# EAGLE design DipSeq_panel_12HP_20150408 (EAGLE 7.1.0)
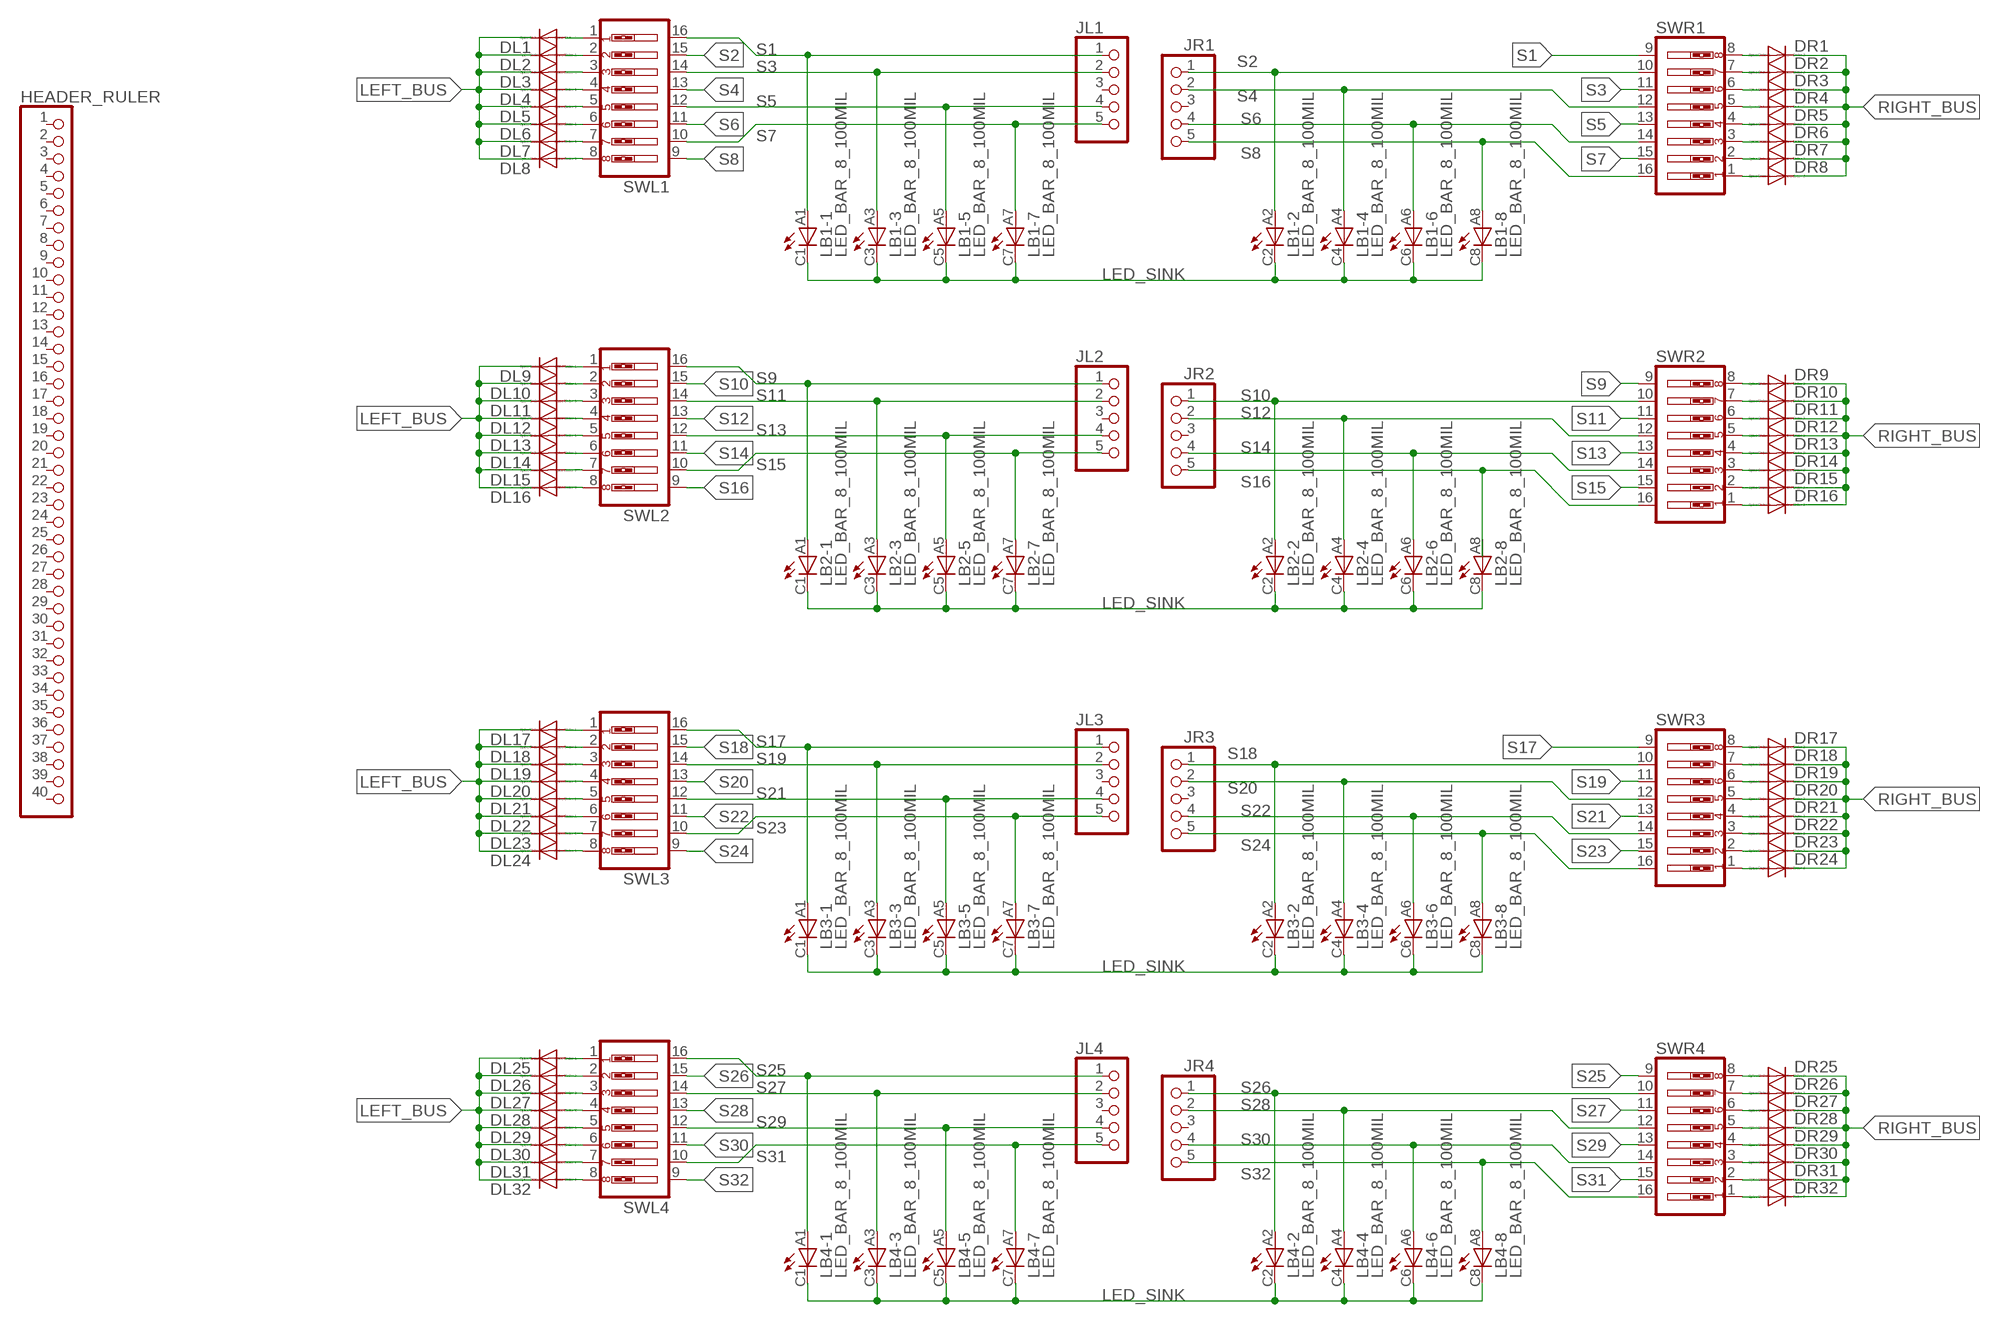
[diagram p0: schematic, sheet 1]

## Parts
DL1  DIODE-SOD323-W  [SOD323-W]
DL2  DIODE-SOD323-W  [SOD323-W]
DL3  DIODE-SOD323-W  [SOD323-W]
DL4  DIODE-SOD323-W  [SOD323-W]
DL5  DIODE-SOD323-W  [SOD323-W]
DL6  DIODE-SOD323-W  [SOD323-W]
DL7  DIODE-SOD323-W  [SOD323-W]
DL8  DIODE-SOD323-W  [SOD323-W]
DL9  DIODE-SOD323-W  [SOD323-W]
DL10  DIODE-SOD323-W  [SOD323-W]
DL11  DIODE-SOD323-W  [SOD323-W]
DL12  DIODE-SOD323-W  [SOD323-W]
DL13  DIODE-SOD323-W  [SOD323-W]
DL14  DIODE-SOD323-W  [SOD323-W]
DL15  DIODE-SOD323-W  [SOD323-W]
DL16  DIODE-SOD323-W  [SOD323-W]
DL17  DIODE-SOD323-W  [SOD323-W]
DL18  DIODE-SOD323-W  [SOD323-W]
DL19  DIODE-SOD323-W  [SOD323-W]
DL20  DIODE-SOD323-W  [SOD323-W]
DL21  DIODE-SOD323-W  [SOD323-W]
DL22  DIODE-SOD323-W  [SOD323-W]
DL23  DIODE-SOD323-W  [SOD323-W]
DL24  DIODE-SOD323-W  [SOD323-W]
DL25  DIODE-SOD323-W  [SOD323-W]
DL26  DIODE-SOD323-W  [SOD323-W]
DL27  DIODE-SOD323-W  [SOD323-W]
DL28  DIODE-SOD323-W  [SOD323-W]
DL29  DIODE-SOD323-W  [SOD323-W]
DL30  DIODE-SOD323-W  [SOD323-W]
DL31  DIODE-SOD323-W  [SOD323-W]
DL32  DIODE-SOD323-W  [SOD323-W]
DR1  DIODE-SOD323-W  [SOD323-W]
DR2  DIODE-SOD323-W  [SOD323-W]
DR3  DIODE-SOD323-W  [SOD323-W]
DR4  DIODE-SOD323-W  [SOD323-W]
DR5  DIODE-SOD323-W  [SOD323-W]
DR6  DIODE-SOD323-W  [SOD323-W]
DR7  DIODE-SOD323-W  [SOD323-W]
DR8  DIODE-SOD323-W  [SOD323-W]
DR9  DIODE-SOD323-W  [SOD323-W]
DR10  DIODE-SOD323-W  [SOD323-W]
DR11  DIODE-SOD323-W  [SOD323-W]
DR12  DIODE-SOD323-W  [SOD323-W]
DR13  DIODE-SOD323-W  [SOD323-W]
DR14  DIODE-SOD323-W  [SOD323-W]
DR15  DIODE-SOD323-W  [SOD323-W]
DR16  DIODE-SOD323-W  [SOD323-W]
DR17  DIODE-SOD323-W  [SOD323-W]
DR18  DIODE-SOD323-W  [SOD323-W]
DR19  DIODE-SOD323-W  [SOD323-W]
DR20  DIODE-SOD323-W  [SOD323-W]
DR21  DIODE-SOD323-W  [SOD323-W]
DR22  DIODE-SOD323-W  [SOD323-W]
DR23  DIODE-SOD323-W  [SOD323-W]
DR24  DIODE-SOD323-W  [SOD323-W]
DR25  DIODE-SOD323-W  [SOD323-W]
DR26  DIODE-SOD323-W  [SOD323-W]
DR27  DIODE-SOD323-W  [SOD323-W]
DR28  DIODE-SOD323-W  [SOD323-W]
DR29  DIODE-SOD323-W  [SOD323-W]
DR30  DIODE-SOD323-W  [SOD323-W]
DR31  DIODE-SOD323-W  [SOD323-W]
DR32  DIODE-SOD323-W  [SOD323-W]
HEADER_RULER  PINHD-1X40  [1X40]
JL1  PINHD-1X5  [1X05]
JL2  PINHD-1X5  [1X05]
JL3  PINHD-1X5  [1X05]
JL4  PINHD-1X5  [1X05]
JR1  PINHD-1X5  [1X05]
JR2  PINHD-1X5  [1X05]
JR3  PINHD-1X5  [1X05]
JR4  PINHD-1X5  [1X05]
LB1  LED_BAR_8_100MIL  [LED_BAR_8]
LB2  LED_BAR_8_100MIL  [LED_BAR_8]
LB3  LED_BAR_8_100MIL  [LED_BAR_8]
LB4  LED_BAR_8_100MIL  [LED_BAR_8]
SWL1  SW_DIP-8PIANO_STYLE  [PIANO_DIPSWITCH_08]
SWL2  SW_DIP-8PIANO_STYLE  [PIANO_DIPSWITCH_08]
SWL3  SW_DIP-8PIANO_STYLE  [PIANO_DIPSWITCH_08]
SWL4  SW_DIP-8PIANO_STYLE  [PIANO_DIPSWITCH_08]
SWR1  SW_DIP-8PIANO_STYLE  [PIANO_DIPSWITCH_08]
SWR2  SW_DIP-8PIANO_STYLE  [PIANO_DIPSWITCH_08]
SWR3  SW_DIP-8PIANO_STYLE  [PIANO_DIPSWITCH_08]
SWR4  SW_DIP-8PIANO_STYLE  [PIANO_DIPSWITCH_08]

## Nets
LED_SINK: LB1.C1(-1:C) LB1.C2(-2:C) LB1.C3(-3:C) LB1.C4(-4:C) LB1.C5(-5:C) LB1.C6(-6:C) LB1.C7(-7:C) LB1.C8(-8:C) LB2.C1(-1:C) LB2.C2(-2:C) LB2.C3(-3:C) LB2.C4(-4:C) LB2.C5(-5:C) LB2.C6(-6:C) LB2.C7(-7:C) LB2.C8(-8:C) LB3.C1(-1:C) LB3.C2(-2:C) LB3.C3(-3:C) LB3.C4(-4:C) LB3.C5(-5:C) LB3.C6(-6:C) LB3.C7(-7:C) LB3.C8(-8:C) LB4.C1(-1:C) LB4.C2(-2:C) LB4.C3(-3:C) LB4.C4(-4:C) LB4.C5(-5:C) LB4.C6(-6:C) LB4.C7(-7:C) LB4.C8(-8:C)
LEFT_BUS: DL1.C DL2.C DL3.C DL4.C DL5.C DL6.C DL7.C DL8.C DL9.C DL10.C DL11.C DL12.C DL13.C DL14.C DL15.C DL16.C DL17.C DL18.C DL19.C DL20.C DL21.C DL22.C DL23.C DL24.C DL25.C DL26.C DL27.C DL28.C DL29.C DL30.C DL31.C DL32.C
N$1: DL1.A SWL1.1
N$2: DL2.A SWL1.2
N$3: DL3.A SWL1.3
N$4: DL4.A SWL1.4
N$17: DL5.A SWL1.5
N$18: DL6.A SWL1.6
N$19: DL7.A SWL1.7
N$20: DL8.A SWL1.8
N$21: DR1.A SWR1.8
N$22: DR2.A SWR1.7
N$23: DR3.A SWR1.6
N$24: DR8.A SWR1.1
N$25: DR7.A SWR1.2
N$26: DR6.A SWR1.3
N$27: DR5.A SWR1.4
N$28: DR4.A SWR1.5
N$29: DL9.A SWL2.1
N$30: DL10.A SWL2.2
N$31: DL11.A SWL2.3
N$32: DL12.A SWL2.4
N$33: DL15.A SWL2.7
N$34: DL16.A SWL2.8
N$35: DR9.A SWR2.8
N$36: DR10.A SWR2.7
N$37: DR11.A SWR2.6
N$38: DR16.A SWR2.1
N$39: DR15.A SWR2.2
N$40: DR14.A SWR2.3
N$41: DR13.A SWR2.4
N$42: DR12.A SWR2.5
N$43: DL13.A SWL2.5
N$44: DL14.A SWL2.6
N$45: DL17.A SWL3.1
N$46: DL18.A SWL3.2
N$47: DL19.A SWL3.3
N$48: DL20.A SWL3.4
N$49: DL23.A SWL3.7
N$50: DL24.A SWL3.8
N$51: DR17.A SWR3.8
N$52: DR18.A SWR3.7
N$53: DR19.A SWR3.6
N$54: DR24.A SWR3.1
N$55: DR23.A SWR3.2
N$56: DR22.A SWR3.3
N$57: DR21.A SWR3.4
N$58: DR20.A SWR3.5
N$59: DL21.A SWL3.5
N$60: DL22.A SWL3.6
N$61: DL25.A SWL4.1
N$62: DL26.A SWL4.2
N$63: DL27.A SWL4.3
N$64: DL28.A SWL4.4
N$65: DL31.A SWL4.7
N$66: DL32.A SWL4.8
N$67: DR25.A SWR4.8
N$68: DR26.A SWR4.7
N$69: DR27.A SWR4.6
N$70: DR32.A SWR4.1
N$71: DR31.A SWR4.2
N$72: DR30.A SWR4.3
N$73: DR29.A SWR4.4
N$74: DR28.A SWR4.5
N$75: DL29.A SWL4.5
N$76: DL30.A SWL4.6
RIGHT_BUS: DR1.C DR2.C DR3.C DR4.C DR5.C DR6.C DR7.C DR8.C DR9.C DR10.C DR11.C DR12.C DR13.C DR14.C DR15.C DR16.C DR17.C DR18.C DR19.C DR20.C DR21.C DR22.C DR23.C DR24.C DR25.C DR26.C DR27.C DR28.C DR29.C DR30.C DR31.C DR32.C
S1: JL1.1 LB1.A1(-1:A) SWL1.16 SWR1.9
S2: JR1.1 LB1.A2(-2:A) SWL1.15 SWR1.10
S3: JL1.2 LB1.A3(-3:A) SWL1.14 SWR1.11
S4: JR1.2 LB1.A4(-4:A) SWL1.13 SWR1.12
S5: JL1.4 LB1.A5(-5:A) SWL1.12 SWR1.13
S6: JR1.4 LB1.A6(-6:A) SWL1.11 SWR1.14
S7: JL1.5 LB1.A7(-7:A) SWL1.10 SWR1.15
S8: JR1.5 LB1.A8(-8:A) SWL1.9 SWR1.16
S9: JL2.1 LB2.A1(-1:A) SWL2.16 SWR2.9
S10: JR2.1 LB2.A2(-2:A) SWL2.15 SWR2.10
S11: JL2.2 LB2.A3(-3:A) SWL2.14 SWR2.11
S12: JR2.2 LB2.A4(-4:A) SWL2.13 SWR2.12
S13: JL2.4 LB2.A5(-5:A) SWL2.12 SWR2.13
S14: JR2.4 LB2.A6(-6:A) SWL2.11 SWR2.14
S15: JL2.5 LB2.A7(-7:A) SWL2.10 SWR2.15
S16: JR2.5 SWL2.9 SWR2.16
S17: JL3.1 LB3.A1(-1:A) SWL3.16 SWR3.9
S18: JR3.1 LB3.A2(-2:A) SWL3.15 SWR3.10
S19: JL3.2 LB3.A3(-3:A) SWL3.14 SWR3.11
S20: JR3.2 LB3.A4(-4:A) SWL3.13 SWR3.12
S21: JL3.4 LB3.A5(-5:A) SWL3.12 SWR3.13
S22: JR3.4 LB3.A6(-6:A) SWL3.11 SWR3.14
S23: JL3.5 LB3.A7(-7:A) SWL3.10 SWR3.15
S24: JR3.5 LB3.A8(-8:A) SWL3.9 SWR3.16
S25: JL4.1 LB4.A1(-1:A) SWL4.16 SWR4.9
S26: JR4.1 LB4.A2(-2:A) SWL4.15 SWR4.10
S27: JL4.2 LB4.A3(-3:A) SWL4.14 SWR4.11
S28: JR4.2 LB4.A4(-4:A) SWL4.13 SWR4.12
S29: JL4.4 LB4.A5(-5:A) SWL4.12 SWR4.13
S30: JR4.4 LB4.A6(-6:A) SWL4.11 SWR4.14
S31: JL4.5 LB4.A7(-7:A) SWL4.10 SWR4.15
S32: JR4.5 LB4.A8(-8:A) SWL4.9 SWR4.16
Unconnected: HEADER_RULER.1 HEADER_RULER.2 HEADER_RULER.3 HEADER_RULER.4 HEADER_RULER.5 HEADER_RULER.6 HEADER_RULER.7 HEADER_RULER.8 HEADER_RULER.9 HEADER_RULER.10 HEADER_RULER.11 HEADER_RULER.12 HEADER_RULER.13 HEADER_RULER.14 HEADER_RULER.15 HEADER_RULER.16 HEADER_RULER.17 HEADER_RULER.18 HEADER_RULER.19 HEADER_RULER.20 HEADER_RULER.21 HEADER_RULER.22 HEADER_RULER.23 HEADER_RULER.24 HEADER_RULER.25 HEADER_RULER.26 HEADER_RULER.27 HEADER_RULER.28 HEADER_RULER.29 HEADER_RULER.30 HEADER_RULER.31 HEADER_RULER.32 HEADER_RULER.33 HEADER_RULER.34 HEADER_RULER.35 HEADER_RULER.36 HEADER_RULER.37 HEADER_RULER.38 HEADER_RULER.39 HEADER_RULER.40 JL1.3 JL2.3 JL3.3 JL4.3 JR1.3 JR2.3 JR3.3 JR4.3 LB2.A8(-8:A)

## Library data of the parts
DL1-DL32 DR1-DR32 = diode:DIODE-: DIODE
HEADER_RULER = pinhead:PINHD-1X40: PIN HEADER
JL1-JL4 JR1-JR4 = amdagan:PINHD-1X5: PIN HEADER
LB1-LB4 = amdagan:LED_BAR_8_100MIL: LED BLOCK 8-LED bar graph, DIL Dealextreme SKU 307214
SWL1-SWL4 SWR1-SWR4 = amdagan:SW_DIP-8: DIP SWITCH

## Board
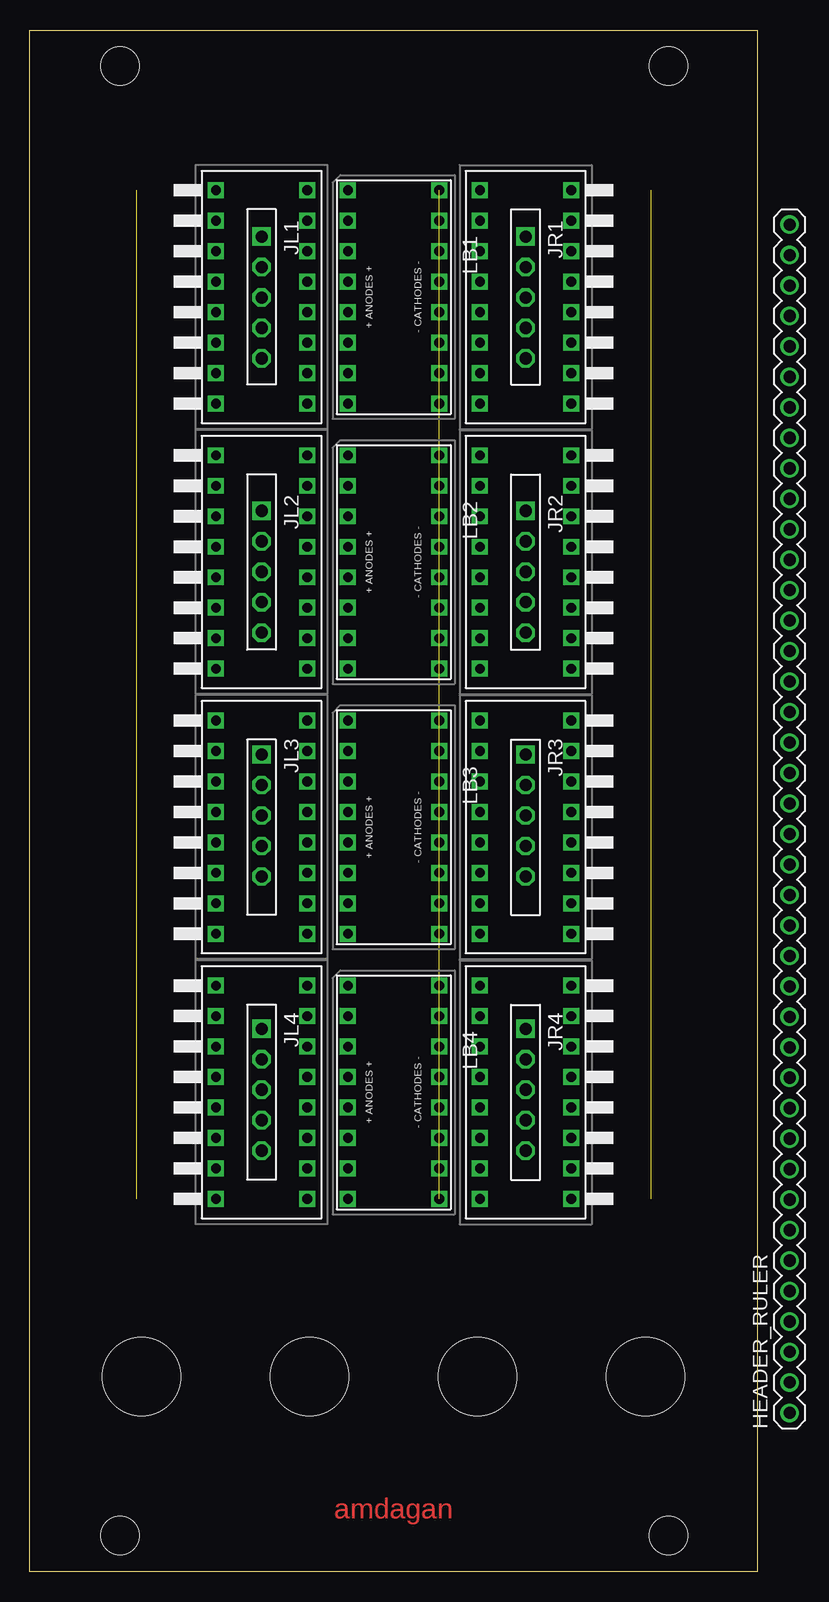
[diagram p1: board, top side]
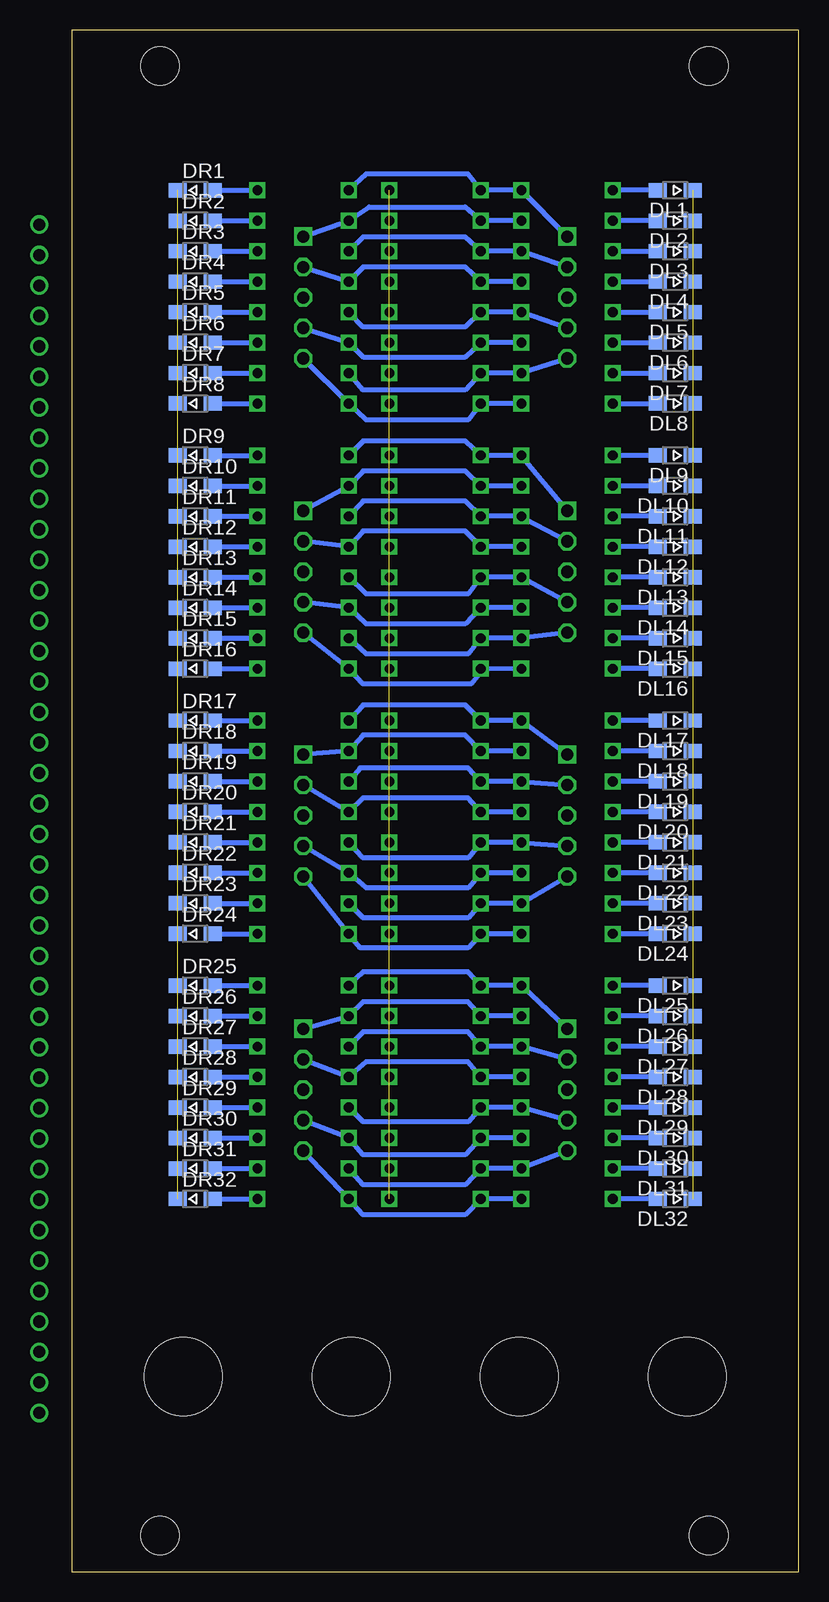
[diagram p2: board, bottom side, seen from below]

Size 60.6 x 128.5 mm. Coordinates in mm from the lower left corner, seen from the top.
Outline: 0,128.5 60.6,128.5 60.6,0 0,0 0,128.5
Copper layers (1*16): Top 0.035mm / dielectric 1.5mm / Bottom 0.035mm
Design rules "default": minimum track width 10mil, minimum drill 24mil, track to track 8mil, track to pad 8mil, pad to pad 8mil, via to via 8mil, smd to smd 8mil, copper to edge 40mil, drill to drill 8mil, minimum pad ring 10mil, minimum via ring 8mil, stop-mask expansion 4mil, vias tented up to drill 0mil, thermal gap 10mil
Holes 3.2 mm at 7.5,3 53.22,3 7.5,125.5 53.22,125.5

### Footprints (pad centres in the part's own frame; a part is rotated, then mirrored left to right if it is on the bottom)
SOD323-W = smd 1.5 x 1.2: A 1.45,0; C -1.45,0
1X40 = drill 1.016: 1 -49.53,0; 2 -46.99,0; 3 -44.45,0; 4 -41.91,0; 5 -39.37,0; 6 -36.83,0; 7 -34.29,0; 8 -31.75,0; 9 -29.21,0; 10 -26.67,0; 11 -24.13,0; 12 -21.59,0; 13 -19.05,0; 14 -16.51,0; 15 -13.97,0; 16 -11.43,0; 17 -8.89,0; 18 -6.35,0; 19 -3.81,0; 20 -1.27,0; 21 1.27,0; 22 3.81,0; 23 6.35,0; 24 8.89,0; 25 11.43,0; 26 13.97,0; 27 16.51,0; 28 19.05,0; 29 21.59,0; 30 24.13,0; 31 26.67,0; 32 29.21,0; 33 31.75,0; 34 34.29,0; 35 36.83,0; 36 39.37,0; 37 41.91,0; 38 44.45,0; 39 46.99,0; 40 49.53,0
1X05 = drill 1.016 square: 1 -5.08,0 | drill 1.016 octagon: 2 -2.54,0; 3 0,0; 4 2.54,0; 5 5.08,0
LED_BAR_8 = drill 0.813 square: A1 -8.89,-3.81; A2 -6.35,-3.81; A3 -3.81,-3.81; A4 -1.27,-3.81; A5 1.27,-3.81; A6 3.81,-3.81; A7 6.35,-3.81; A8 8.89,-3.81; C1 -8.89,3.81; C2 -6.35,3.81; C3 -3.81,3.81; C4 -1.27,3.81; C5 1.27,3.81; C6 3.81,3.81; C7 6.35,3.81; C8 8.89,3.81
JACK_PANEL = hole 6.5: 0,0
PIANO_DIPSWITCH_08 = drill 0.813 square: 1 -8.89,-3.81; 2 -6.35,-3.81; 3 -3.81,-3.81; 4 -1.27,-3.81; 5 1.27,-3.81; 6 3.81,-3.81; 7 6.35,-3.81; 8 8.89,-3.81; 9 8.89,3.81; 10 6.35,3.81; 11 3.81,3.81; 12 1.27,3.81; 13 -1.27,3.81; 14 -3.81,3.81; 15 -6.35,3.81; 16 -8.89,3.81

### Placement (x,y rotation side)
DL1  10.3,115.14 180 bottom
DL2  10.3,112.6 180 bottom
DL3  10.3,110.06 180 bottom
DL4  10.3,107.52 180 bottom
DL5  10.3,104.98 180 bottom
DL6  10.3,102.44 180 bottom
DL7  10.3,99.9 180 bottom
DL8  10.3,97.36 180 bottom
DL9  10.3,93.04 180 bottom
DL10  10.3,90.5 180 bottom
DL11  10.3,87.96 180 bottom
DL12  10.3,85.42 180 bottom
DL13  10.3,82.88 180 bottom
DL14  10.3,80.34 180 bottom
DL15  10.3,77.8 180 bottom
DL16  10.3,75.26 180 bottom
DL17  10.3,70.94 180 bottom
DL18  10.3,68.4 180 bottom
DL19  10.3,65.86 180 bottom
DL20  10.3,63.32 180 bottom
DL21  10.3,60.78 180 bottom
DL22  10.3,58.24 180 bottom
DL23  10.3,55.7 180 bottom
DL24  10.3,53.16 180 bottom
DL25  10.3,48.84 180 bottom
DL26  10.3,46.3 180 bottom
DL27  10.3,43.76 180 bottom
DL28  10.3,41.22 180 bottom
DL29  10.3,38.68 180 bottom
DL30  10.3,36.14 180 bottom
DL31  10.3,33.6 180 bottom
DL32  10.3,31.06 180 bottom
DR1  50.3,115.14 0 bottom
DR2  50.3,112.6 0 bottom
DR3  50.3,110.06 0 bottom
DR4  50.3,107.52 0 bottom
DR5  50.3,104.98 0 bottom
DR6  50.3,102.44 0 bottom
DR7  50.3,99.9 0 bottom
DR8  50.3,97.36 0 bottom
DR9  50.3,93.04 0 bottom
DR10  50.3,90.5 0 bottom
DR11  50.3,87.96 0 bottom
DR12  50.3,85.42 0 bottom
DR13  50.3,82.88 0 bottom
DR14  50.3,80.34 0 bottom
DR15  50.3,77.8 0 bottom
DR16  50.3,75.26 0 bottom
DR17  50.3,70.94 0 bottom
DR18  50.3,68.4 0 bottom
DR19  50.3,65.86 0 bottom
DR20  50.3,63.32 0 bottom
DR21  50.3,60.78 0 bottom
DR22  50.3,58.24 0 bottom
DR23  50.3,55.7 0 bottom
DR24  50.3,53.16 0 bottom
DR25  50.3,48.84 0 bottom
DR26  50.3,46.3 0 bottom
DR27  50.3,43.76 0 bottom
DR28  50.3,41.22 0 bottom
DR29  50.3,38.68 0 bottom
DR30  50.3,36.14 0 bottom
DR31  50.3,33.6 0 bottom
DR32  50.3,31.06 0 bottom
HEADER_RULER  63.3,62.75 90 top
JL1  19.3,106.2 270 top
JL2  19.3,83.34 270 top
JL3  19.3,63.02 270 top
JL4  19.3,40.16 270 top
JR1  41.3,106.2 270 top
JR2  41.3,83.34 270 top
JR3  41.3,63.02 270 top
JR4  41.3,40.16 270 top
LB1  30.3,106.25 270 top
LB2  30.3,84.15 270 top
LB3  30.3,62.05 270 top
LB4  30.3,39.95 270 top
LEG_A  JACK_PANEL  [JACK_PANEL]  23.3,16.25 0 top
LEG_B  JACK_PANEL  [JACK_PANEL]  51.3,16.25 0 top
PUL_A  JACK_PANEL  [JACK_PANEL]  9.3,16.25 0 top
PUL_B  JACK_PANEL  [JACK_PANEL]  37.3,16.25 0 top
SWL1  19.3,106.25 270 top
SWL2  19.3,84.15 270 top
SWL3  19.3,62.05 270 top
SWL4  19.3,39.95 270 top
SWR1  41.3,106.25 90 top
SWR2  41.3,84.15 90 top
SWR3  41.3,62.05 90 top
SWR4  41.3,39.95 90 top

### Tracks (layer width: path | path; a pad name or v marks a point on that pad's centre or on a via)
LED_SINK  (31 unrouted)
LEFT_BUS  (31 unrouted)
N$1
  Bottom 0.406: DL1.A SWL1.1
N$2
  Bottom 0.406: DL2.A SWL1.2
N$3
  Bottom 0.406: SWL1.3 DL3.A
N$4
  Bottom 0.406: SWL1.4 DL4.A
N$17
  Bottom 0.406: SWL1.5 DL5.A
N$18
  Bottom 0.406: SWL1.6 DL6.A
N$19
  Bottom 0.406: SWL1.7 DL7.A
N$20
  Bottom 0.406: SWL1.8 DL8.A
N$21
  Bottom 0.406: DR1.A SWR1.8
N$22
  Bottom 0.406: DR2.A SWR1.7
N$23
  Bottom 0.406: DR3.A SWR1.6
N$24
  Bottom 0.406: DR8.A SWR1.1
N$25
  Bottom 0.406: DR7.A SWR1.2
N$26
  Bottom 0.406: DR6.A SWR1.3
N$27
  Bottom 0.406: DR5.A SWR1.4
N$28
  Bottom 0.406: DR4.A SWR1.5
N$29
  Bottom 0.406: DL9.A SWL2.1
N$30
  Bottom 0.406: DL10.A SWL2.2
N$31
  Bottom 0.406: DL11.A SWL2.3
N$32
  Bottom 0.406: DL12.A SWL2.4
N$33
  Bottom 0.406: DL15.A SWL2.7
N$34
  Bottom 0.406: DL16.A SWL2.8
N$35
  Bottom 0.406: DR9.A SWR2.8
N$36
  Bottom 0.406: DR10.A SWR2.7
N$37
  Bottom 0.406: DR11.A SWR2.6
N$38
  Bottom 0.406: DR16.A SWR2.1
N$39
  Bottom 0.406: DR15.A SWR2.2
N$40
  Bottom 0.406: DR14.A SWR2.3
N$41
  Bottom 0.406: DR13.A SWR2.4
N$42
  Bottom 0.406: DR12.A SWR2.5
N$43
  Bottom 0.406: DL13.A SWL2.5
N$44
  Bottom 0.406: DL14.A SWL2.6
N$45
  Bottom 0.406: DL17.A SWL3.1
N$46
  Bottom 0.406: DL18.A SWL3.2
N$47
  Bottom 0.406: DL19.A SWL3.3
N$48
  Bottom 0.406: DL20.A SWL3.4
N$49
  Bottom 0.406: DL23.A SWL3.7
N$50
  Bottom 0.406: DL24.A SWL3.8
N$51
  Bottom 0.406: DR17.A SWR3.8
N$52
  Bottom 0.406: DR18.A SWR3.7
N$53
  Bottom 0.406: DR19.A SWR3.6
N$54
  Bottom 0.406: DR24.A SWR3.1
N$55
  Bottom 0.406: DR23.A SWR3.2
N$56
  Bottom 0.406: DR22.A SWR3.3
N$57
  Bottom 0.406: DR21.A SWR3.4
N$58
  Bottom 0.406: DR20.A SWR3.5
N$59
  Bottom 0.406: DL21.A SWL3.5
N$60
  Bottom 0.406: DL22.A SWL3.6
N$61
  Bottom 0.406: DL25.A SWL4.1
N$62
  Bottom 0.406: DL26.A SWL4.2
N$63
  Bottom 0.406: DL27.A SWL4.3
N$64
  Bottom 0.406: DL28.A SWL4.4
N$65
  Bottom 0.406: DL31.A SWL4.7
N$66
  Bottom 0.406: DL32.A SWL4.8
N$67
  Bottom 0.406: DR25.A SWR4.8
N$68
  Bottom 0.406: DR26.A SWR4.7
N$69
  Bottom 0.406: DR27.A SWR4.6
N$70
  Bottom 0.406: DR32.A SWR4.1
N$71
  Bottom 0.406: DR31.A SWR4.2
N$72
  Bottom 0.406: DR30.A SWR4.3
N$73
  Bottom 0.406: DR29.A SWR4.4
N$74
  Bottom 0.406: DR28.A SWR4.5
N$75
  Bottom 0.406: DL29.A SWL4.5
N$76
  Bottom 0.406: DL30.A SWL4.6
RIGHT_BUS  (31 unrouted)
S1
  Bottom 0.406: JL1.1 SWL1.16 LB1.A1 27.55,116.5 36.05,116.5 SWR1.9
S2
  Bottom 0.406: SWL1.15 LB1.A2 27.8,113.75 35.8,113.75 SWR1.10 JR1.1
S3
  Bottom 0.406: JL1.2 SWL1.14 LB1.A3 27.8,111.25 36.3,111.25 SWR1.11
S4
  Bottom 0.406: SWL1.13 LB1.A4 27.8,108.75 36.3,108.75 SWR1.12 JR1.2
S5
  Bottom 0.406: JL1.4 SWL1.12 LB1.A5 27.8,103.75 36.3,103.75 SWR1.13
S6
  Bottom 0.406: JR1.4 SWR1.14 36.3,101.25 27.8,101.25 LB1.A6 SWL1.11
S7
  Bottom 0.406: JL1.5 SWL1.10 LB1.A7 27.8,98.5 36.3,98.5 SWR1.15
S8
  Bottom 0.406: JR1.5 SWR1.16 36.05,96 27.55,96 LB1.A8 SWL1.9
S9
  Bottom 0.406: JL2.1 SWL2.16 LB2.A1 27.8,94.25 36.3,94.25 SWR2.9
S10
  Bottom 0.406: SWL2.15 LB2.A2 27.8,91.75 36.3,91.75 SWR2.10 JR2.1
S11
  Bottom 0.406: JL2.2 22.8,87.75 SWL2.14 LB2.A3 27.8,89.25 36.3,89.25 SWR2.11
S12
  Bottom 0.406: SWL2.13 LB2.A4 27.8,86.75 36.3,86.75 SWR2.12 JR2.2
S13
  Bottom 0.406: JL2.4 SWL2.12 LB2.A5 27.55,81.5 36.05,81.5 SWR2.13
S14
  Bottom 0.406: SWL2.11 LB2.A6 27.8,79 36.05,79 SWR2.14 JR2.4
S15
  Bottom 0.406: JL2.5 SWL2.10 LB2.A7 27.55,76.5 36.05,76.5 SWR2.15
S16
  Bottom 0.406: SWL2.9 26.3,75.25 27.3,74 36.3,74 SWR2.16 JR2.5
S17
  Bottom 0.406: JL3.1 SWL3.16 LB3.A1 27.8,72.25 36.3,72.25 SWR3.9
S18
  Bottom 0.406: SWL3.15 LB3.A2 27.8,69.75 36.3,69.75 SWR3.10 JR3.1
S19
  Bottom 0.406: JL3.2 SWL3.14 LB3.A3 27.55,67 36.55,67 SWR3.11
S20
  Bottom 0.406: SWL3.13 LB3.A4 27.55,64.5 36.3,64.5 SWR3.12 JR3.2
S21
  Bottom 0.406: JL3.4 SWL3.12 LB3.A5 27.55,59.5 36.3,59.5 SWR3.13
S22
  Bottom 0.406: SWL3.11 LB3.A6 27.55,57 36.05,57 SWR3.14 JR3.4
S23
  Bottom 0.406: JL3.5 SWL3.10 LB3.A7 27.55,54.5 36.3,54.5 SWR3.15
S24
  Bottom 0.406: SWL3.9 LB3.A8 27.55,52 36.55,52 SWR3.16 JR3.5
S25
  Bottom 0.406: JL4.1 SWL4.16 LB4.A1 27.55,50 36.3,50 SWR4.9
S26
  Bottom 0.406: SWL4.15 LB4.A2 27.55,47.5 36.3,47.5 SWR4.10 JR4.1
S27
  Bottom 0.406: JL4.2 SWL4.14 LB4.A3 27.55,45 36.3,45 SWR4.11
S28
  Bottom 0.406: SWL4.13 LB4.A4 27.55,42.5 36.05,42.5 SWR4.12 JR4.2
S29
  Bottom 0.406: JL4.4 SWL4.12 LB4.A5 27.55,37.5 36.3,37.5 SWR4.13
S30
  Bottom 0.406: SWL4.11 LB4.A6 27.8,34.75 36.3,34.75 SWR4.14 JR4.4
S31
  Bottom 0.406: JL4.5 SWL4.10 LB4.A7 27.8,32.25 36.3,32.25 SWR4.15
S32
  Bottom 0.406: SWL4.9 LB4.A8 27.8,29.75 36.3,29.75 SWR4.16 JR4.5

### Text on the board
Top: amdagan
tStop: DIPSEQ
tDocu: Piano DIP switches: 22x11mm / LED bars: 10.2 * 20.4 | Hole sizes: / / Thonkiconn jack / bushing dia 6mm -> hole 6.5 mm | Modified jack_panel so nut does not obscure label / Thonkiconn nut dia: 8mm / 9.1mm (hex peaks) | Jack spacing: / horz 12mm - as on 6P8J, bit tight / (standard is 14mm) / vert N/A | Clearance needed from PCB edge to panel edge: / Gie-Tec 8.3mm / gave 9.25mm here
bDocu: TODO: / - improve silk in diode footprint? / - route left/right bus, led sink, ground / - panel design | panel PCB dimension: / 128.5 x 60.6 mm / = 7787 mm^2 / = 12.07 sq in